# Altium schematic sheet Flexi_encoder_BOB.SchDoc: RP2040 CNC
size B; Author: AM; CompanyName: Expatria Technologies; DrawnBy: A.Marles; Engineer: AM; Organization: Expatria Technolgoies; Address1: Schematic; DocumentNumber: 2; SheetNumber: 2; SheetTotal: 5
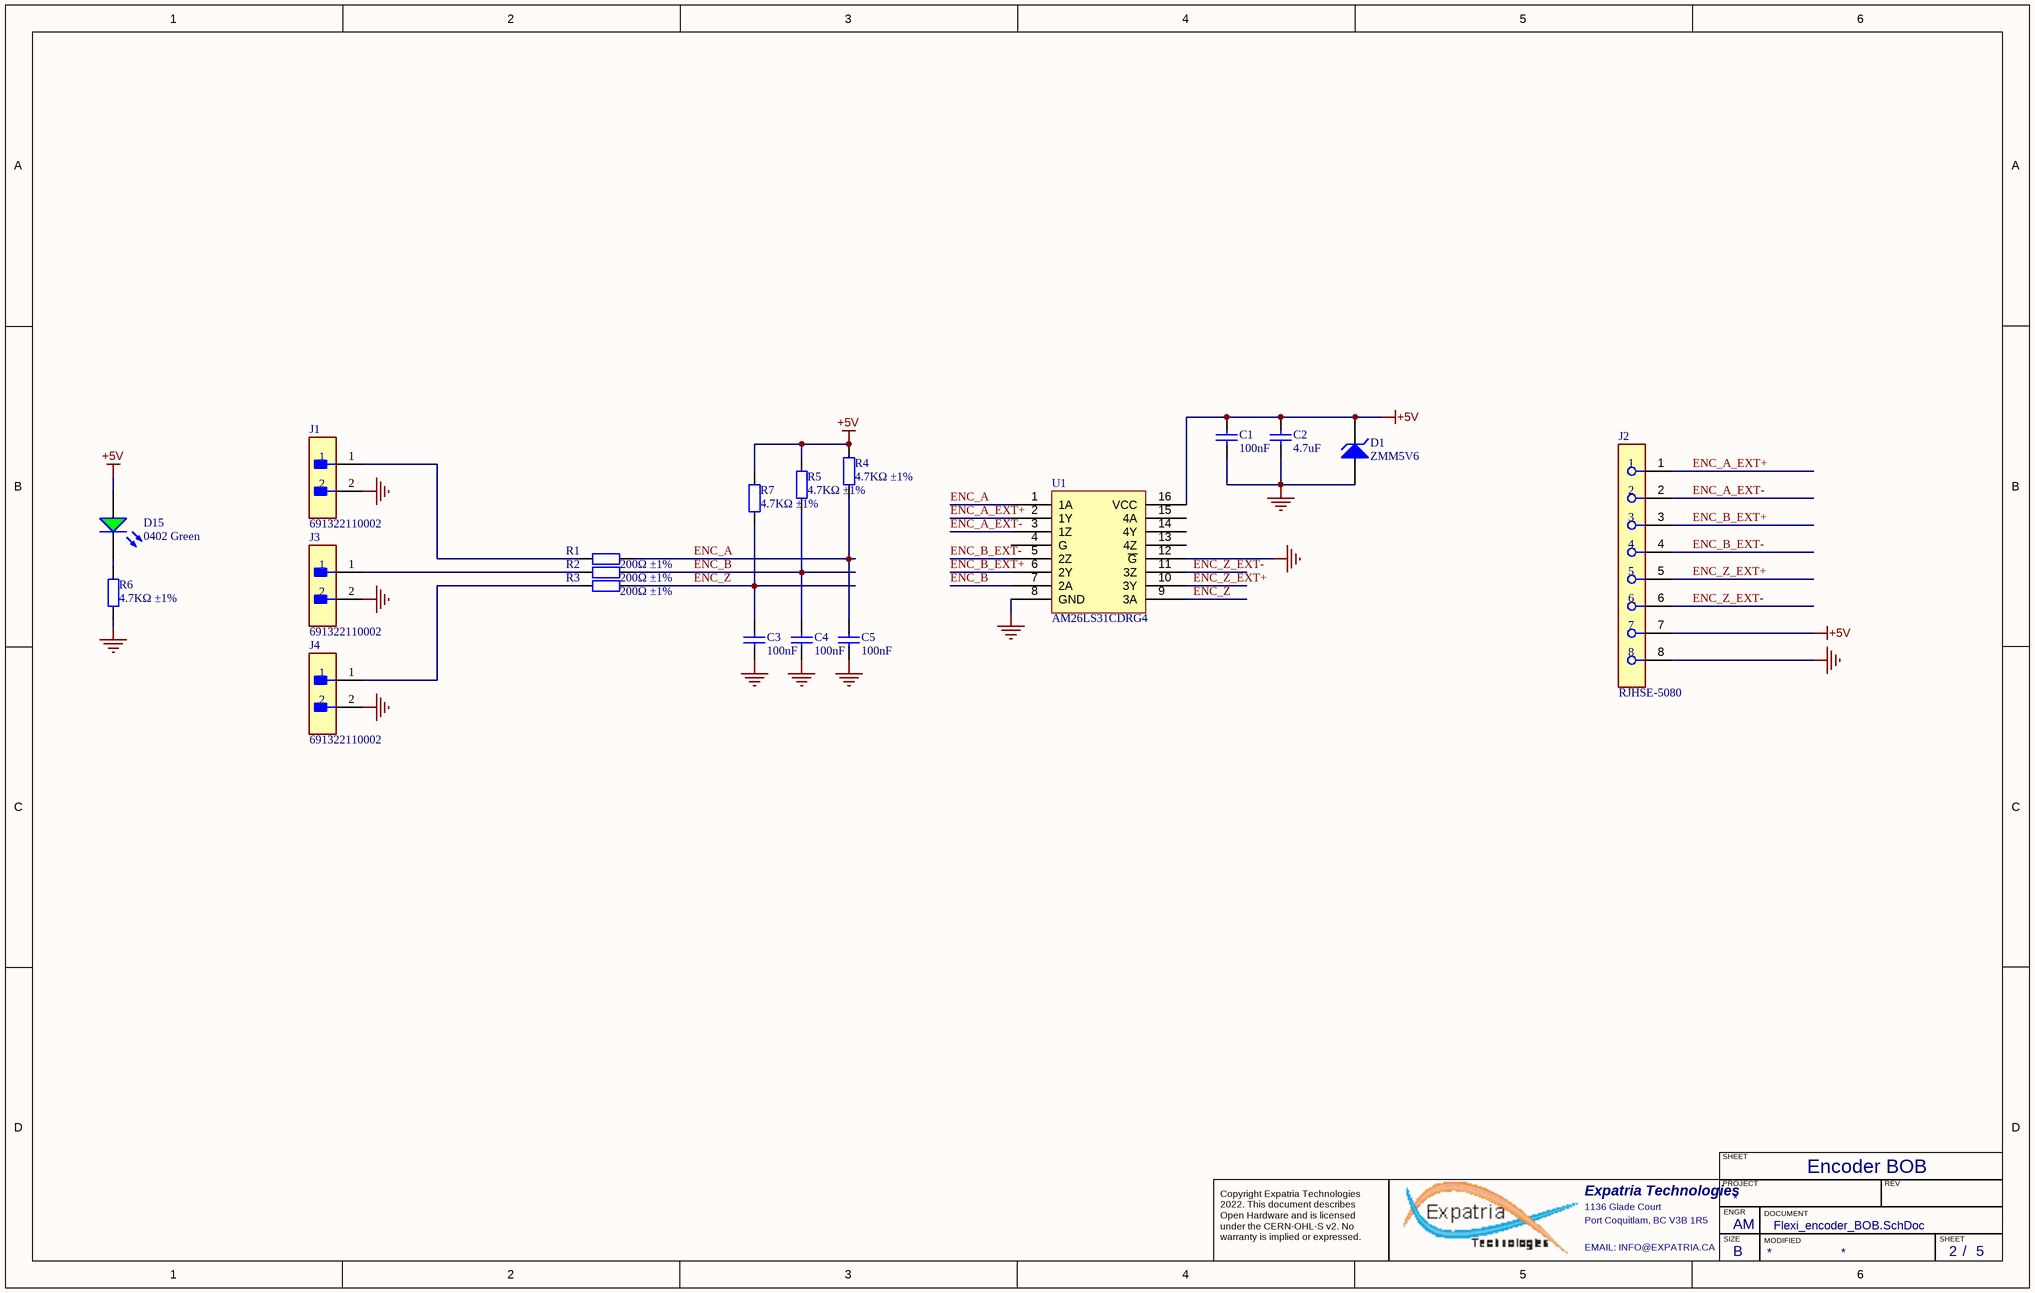
[diagram p0: Flexi_encoder_BOB.SchDoc]

## Parts
C1  100nF  [0402_C]
C2  4.7uF  [0402_C]
C3  100nF  [0402_C]
C4  100nF  [0402_C]
C5  100nF  [0402_C]
D1  ZMM5V6  [LL-34]
D15  0402 Green  [LED 0402_1005 RED]
J1  691322110002  [FP-691322110002-MFG]
J2  RJHSE-5080  [FP-RJHSE-5080-MFG]
J3  691322110002  [FP-691322110002-MFG]
J4  691322110002  [FP-691322110002-MFG]
R1  200Ω ±1%  [0402_R]
R2  200Ω ±1%  [0402_R]
R3  200Ω ±1%  [0402_R]
R4  4.7KΩ ±1%  [0402_R]
R5  4.7KΩ ±1%  [0402_R]
R6  4.7KΩ ±1%  [0402_R]
R7  4.7KΩ ±1%  [0402_R]
U1  AM26LS31CDRG4  [SOIC-16_150mil]

## Nets
+5V: C1.1 C2.1 D1.2(K) D15.A J2.7 R4.2 R5.2 R7.2 U1.16(VCC)
GND: C1.2 C2.2 C3.2 C4.2 C5.2 D1.1(A) J1.2 J2.8 J3.2 J4.2 R6.1 U1.8(GND) U1.12(~{G})
ENC_A: C5.1 R1.1 R4.1 U1.1(1A)
ENC_A_EXT+: J2.1 U1.2(1Y)
ENC_A_EXT-: J2.2 U1.3(1Z)
ENC_B: C4.1 R2.1 R5.1 U1.7(2A)
ENC_B_EXT+: J2.3 U1.6(2Y)
ENC_B_EXT-: J2.4 U1.5(2Z)
ENC_Z: C3.1 R3.1 R7.1 U1.9(3A)
ENC_Z_EXT+: J2.5 U1.10(3Y)
ENC_Z_EXT-: J2.6 U1.11(3Z)
NetD15_K: D15.K R6.2
NetJ1_1: J1.1 R1.2
NetJ3_1: J3.1 R2.2
NetJ4_1: J4.1 R3.2

Not connected (* = marked no-connect by the designer): U1 4(G) 13(4Z) 14(4Y) 15(4A)

## Notes on the sheet
- Encoder BOB
- SHEET
- Expatria Technologies
- 1136 Glade Court
- Port Coquitlam, BC V3B 1R5
- PROJECT
- SIZE
- ENGR
- MODIFIED
- DOCUMENT
- REV
- Copyright Expatria Technologies 2022. This document describes Open Hardware and is licensed under the CERN-OHL-S v2. No warranty is implied or expressed.
- EMAIL: INFO@EXPATRIA.CA
- B
- /

## Library data of the parts
C1 C3-C5 = 0402 100nF (104) 10% 16V: Chip capacitors; Manufacturer: Samsung Electro-Mechanics; PartNumber: CL05B104KO5NNNC; Tolerance: 10%; Voltage: 16V; ComponentLink1Description: Supplier link; ComponentLink1URL: http://www.szlcsc.com/product/details_1877.html; Package: 0402; Supplier: LC; SuppliersPartNumber: C1525; Capacitance: 100nF
C2 = 0402 4.7uF (475) 20% 10V: Chip capacitor; Manufacturer: Samsung Electro-Mechanics; PartNumber: CL05A475MP5NRNC; Tolerance: 20%; Voltage: 10V; ComponentLink1Description: Supplier link; ComponentLink1URL: http://www.szlcsc.com/product/details_24469.html; Package: 0402; Supplier: LC; SuppliersPartNumber: C23733; Capacitance: 4.7uF
D1 = LL-34 ZMM5V6: 500mW - 0.1uA @ 1V 5.6V LL-34 Zener Diodes ROHS; ComponentLink1Description: 供应商链接; ComponentLink1URL: http://www.szlcsc.com/product/details_8541.html; Package: LL-34; Supplier: LC; SuppliersPartNumber: C8062
D15 = 0402 LED Green: LED; Package: 0402; Supplier: LC; SuppliersPartNumber: C130723; Color: Green
J1 J3 J4 = CMP-1502-01791-2: TERM BLOCK HDR 2POS 90DEG 3.5MM; Voltage: 300V; Current: 10A; Number of Levels: 1; Number of Positions: 2; Length: 10.5mm; Pitch: 3.5mm; Color: Green; Mount: Through Hole; Package Quantity: 1000; Series: WR-TBL Series 3221; Contact Material: Brass; RoHS Compliant: Yes; Width: 8.1mm; Housing Material: Nylon; Flammability Rating: UL94 V-0; Lead Free: Lead Free; Termination: Solder; Number of Contacts: 2; Packaging: Bulk; Number of Rows: 1; Height: 9.2mm; Number of Positions Per Level: 2
J2 = CMP-02366-000003-1: CONN MOD JACK 8P8C R/A UNSHLD; Manufacturer Part Number: E5J88-00LJG2-L; Manufacturer: Pulse Electronics Network; Pitch: 1.02mm; ComponentLink2URL: https://cdn.amphenol-icc.com/media/wysiwyg/files/documentation/datasheet/inputoutput/io-modjack-rjhse.pdf; Device Class L1: Connectors; Package: CONN_MOD_JACK; Digikey Description: CONN MOD JACK 8P8C R/A UNSHLD; ComponentLink2Description: Datasheet; SuppliersPartNumber: C385834
R1-R3 = 0402 200R (2000) 1%: Chip resistor; Manufacturer: Uniroyal Elec; PartNumber: 0402WGF2000TCE; Power: 1/16W; ComponentLink1Description: Supplier link; ComponentLink1URL: http://www.szlcsc.com/product/details_25830.html; Package: 0402; Supplier: LC; SuppliersPartNumber: C25087; Resistance: 200Ω; Tolerance: 1%
R4-R7 = 0402 4.7K (4701) 1%: Chip resistor; Manufacturer: Uniroyal Elec; PartNumber: 0402WGF4701TCE; Power: 1/16W; ComponentLink1Description: Supplier link; ComponentLink1URL: http://www.szlcsc.com/product/details_26643.html; Package: 0402; Supplier: LC; SuppliersPartNumber: C25900; Resistance: 4.7KΩ; Tolerance: 1%
U1 = AM26LS31CDRG4_[C6179]: 4/0 Driver - RS422, RS485 16-SOIC; Manufacturer 1: Texas Instruments; ComponentLink1Description: 供应商链接; ComponentLink1URL: http://www.szlcsc.com/product/details_6645.html; Package: SOIC-16_150mil; Supplier: LC; SuppliersPartNumber: C6179; Manufacturer Part Number 1: AM26LS31CDR